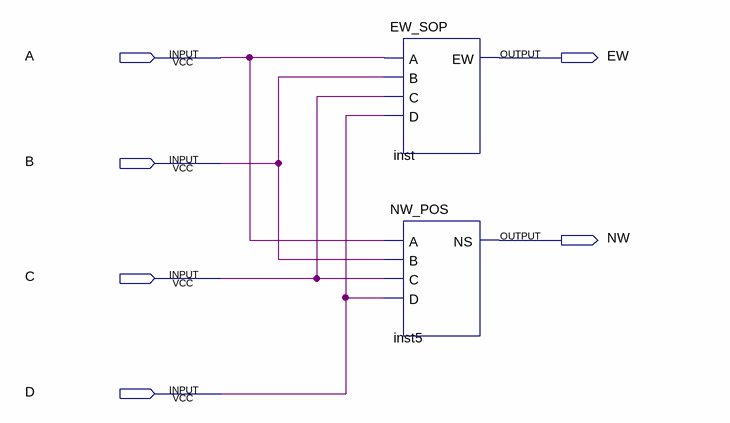
[diagram p0: schematic sheet]
// Quartus schematic results2.bdf as structural Verilog: 2 symbols, 6 pins
module results2 (
  input  A,
  input  B,
  input  C,
  input  D,
  output EW,
  output NW
);

  EW_SOP inst (.A(A), .B(B), .C(C), .D(D), .EW(EW));
  NW_POS inst5 (.A(A), .B(B), .C(C), .D(D), .NS(NW));
endmodule
